# EAGLE design gas (EAGLE 5.10)
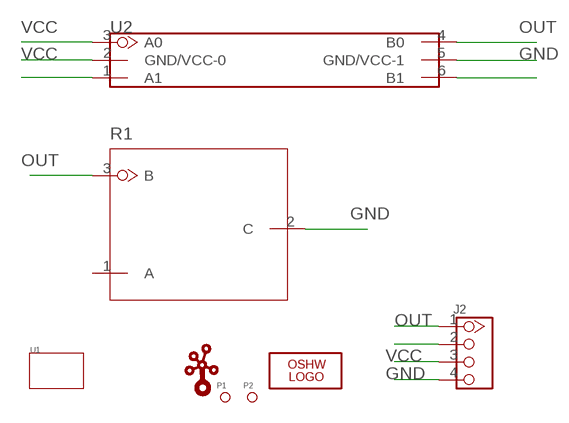
[diagram p0: schematic, sheet 1]

## Parts
J2  TWIG-2.0-LEADED  [4P-LEADED-2.0]
LOGO1  LOGO-OSHW-FILLX0150-NT  [OSHW_FILLX150_NOTEXT]
P1  PAD-MARK  [ROUND-MARK-0.635]
P2  PAD-MARK  [ROUND-MARK-0.635]
R1  DEVICE_RESISTANCE  [PACKAGE__RESISTANCE]
U1  TWIG-2U  [2U-DIM-W/-DRILL]
U2  DEVICE  [PACKAGE]
U$1  TWIGLOGOTWIGLOGO_SMALL  [TWIGLOGO_SMALL]

## Nets
GND: J2.4 R1.2(C) U2.5(GND/VCC-1)
N$1: U2.1(A1)
N$2: U2.6(B1)
N$4: J2.2
OUT: J2.1 R1.3(B) U2.4(B0)
VCC: J2.3 U2.2(GND/VCC-0) U2.3(A0)
Unconnected: R1.1(A)

## Library data of the parts
J2 = Connector:TWIG-2.0-LEADED
LOGO1 = Logo:LOGO-OSHW-FILL
P1 P2 = Discreter:PAD-MARK
R1 = test:DEVICE_RESISTANCE
U1 = Module:TWIG
U2 = MQ-2_EXT:DEVICE
U$1 = seeedleo:TWIGLOGO

## Board
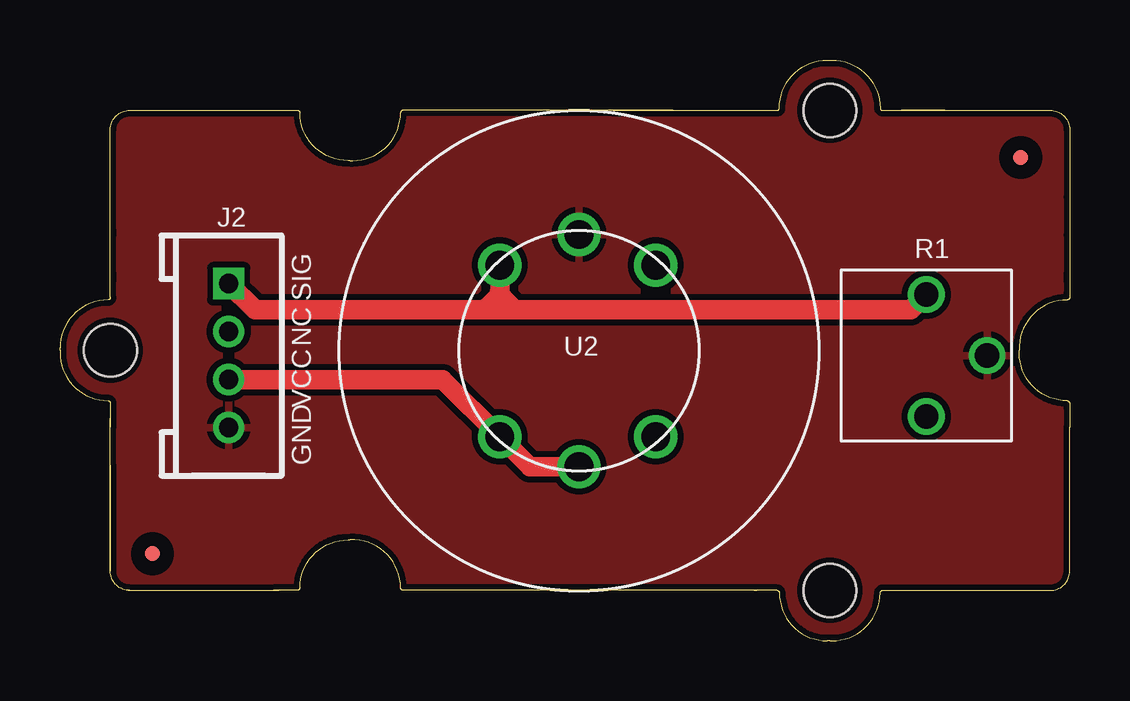
[diagram p1: board, top side]
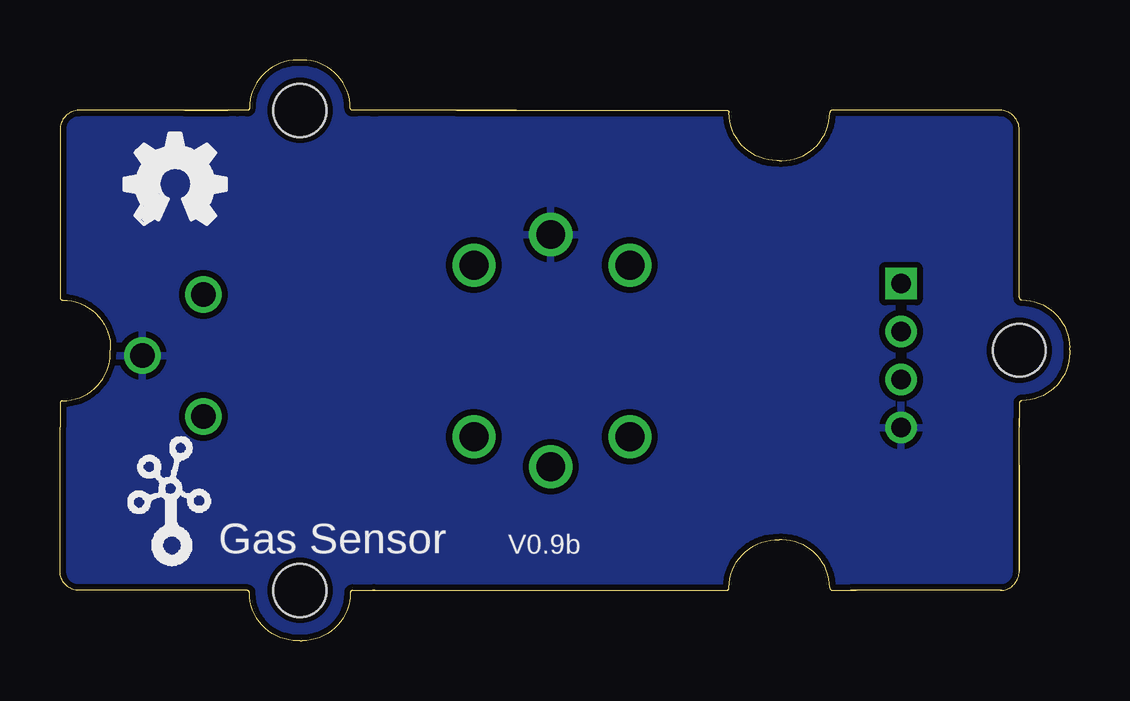
[diagram p2: board, bottom side, seen from below]

Size 42.09 x 24.2 mm. Coordinates in mm from the lower left corner, seen from the top.
Copper layers (1*16): Top 0.035mm / dielectric 1.5mm / Bottom 0.035mm
Design rules "SeeedStudio_rule_090524 *": minimum track width 0.0025mm, minimum drill 10mil, track to track 6mil, track to pad 6mil, pad to pad 6mil, via to via 6mil, smd to smd 6mil, copper to edge 10mil, drill to drill 10mil, minimum pad ring 10mil, minimum via ring 6mil, stop-mask expansion 2mil, vias tented up to drill 100mil, thermal gap 10mil

### Footprints (pad centres in the part's own frame; a part is rotated, then mirrored left to right if it is on the bottom)
4P-LEADED-2.0 = drill 0.8 pad 1.27 square: 1 -3,0 | drill 0.8 pad 1.27 round: 2 -1,0; 3 1,0; 4 3,0
ROUND-MARK-0.635 = smd 0.635 x 0.635: P$1 0,0
PACKAGE__RESISTANCE = drill 1.016 round: 1 -2.286,-0.254; 2 0.254,-2.794; 3 2.794,-0.254
2U-DIM-W/-DRILL = hole 2.2: 10.453,-10.42; 10.453,9.58; -19.535,-0.415
PACKAGE = drill 1.2 round: 1 -3.2,3.587; 2 0,4.838; 3 3.3,3.587; 4 3.3,-3.562; 5 0,-4.838; 6 -3.2,-3.562

### Placement (x,y rotation side)
J2  7.03,11.88 270 top
LOGO1  39.41,17.35 0 bottom
P1  3.86,3.63 0 top
P2  40.05,20.14 0 top
R1  35.86,11.63 90 top
U1  21.64,12.52 0 top
U2  21.64,12.09 180 top
U$1  39.67,3 0 bottom

### Tracks (layer width: path | path; a pad name or v marks a point on that pad's centre or on a via)
GND
  pour Top (isolate 0.254): 0.05,23.95 43.23,23.95 43.23,-0.18 0.05,-0.18
  pour Bottom (isolate 0.254): 0.05,23.95 43.23,23.95 43.23,-0.18 0.05,-0.18
OUT
  Top 0.813: R1.3 35.48,13.79 18.97,13.79 | 18.46,13.79 8.13,13.79 J2.1 | 18.97,13.79 18.46,13.79 | 18.34,14.55 U2.4 | 18.46,13.79 18.34,13.91 18.34,14.55 | 18.34,14.55 18.33,14.55 18.33,14.43 17.83,13.92 | 18.97,13.79 18.46,14.3
VCC
  Top 0.813: J2.3 15.95,10.88 U2.3 19.59,7.25 U2.2

### Text on the board
tPlace: SIG | NC | VCC | GND
bPlace: V0.9b | Gas Sensor
tNames: R1 | U2